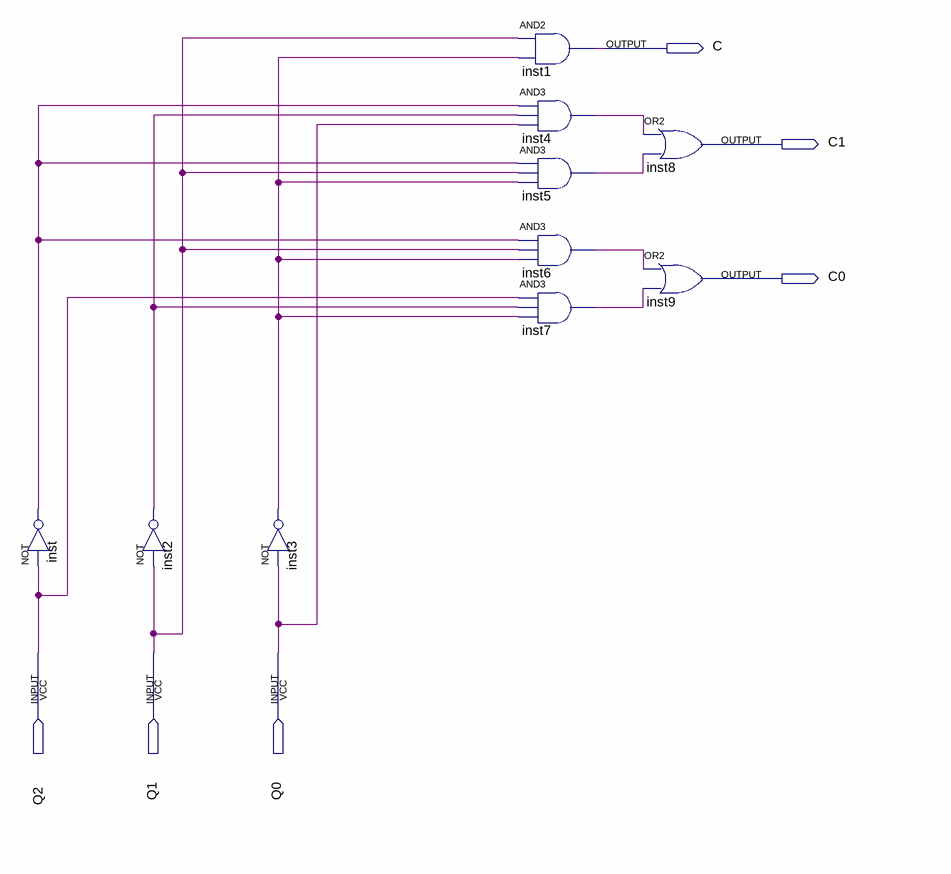
[diagram p0: schematic sheet]
// Quartus schematic C_C3.bdf as structural Verilog: 10 symbols, 6 pins
module C_C3 (
  input  Q2,
  input  Q1,
  input  Q0,
  output C,
  output C1,
  output C0
);

  wire inst2_out, inst3_out, inst4_out, inst5_out, inst6_out, inst7_out, inst_out;

  not inst (inst_out, Q2);
  not inst2 (inst2_out, Q1);
  not inst3 (inst3_out, Q0);
  and inst1 (C, Q1, inst3_out);
  and inst4 (inst4_out, inst_out, inst2_out, Q0);
  and inst5 (inst5_out, inst_out, Q1, inst3_out);
  and inst6 (inst6_out, inst_out, Q1, inst3_out);
  and inst7 (inst7_out, Q2, inst2_out, inst3_out);
  or inst8 (C1, inst4_out, inst5_out);
  or inst9 (C0, inst6_out, inst7_out);
endmodule
